# Altium project picoNODE.PrjPcb
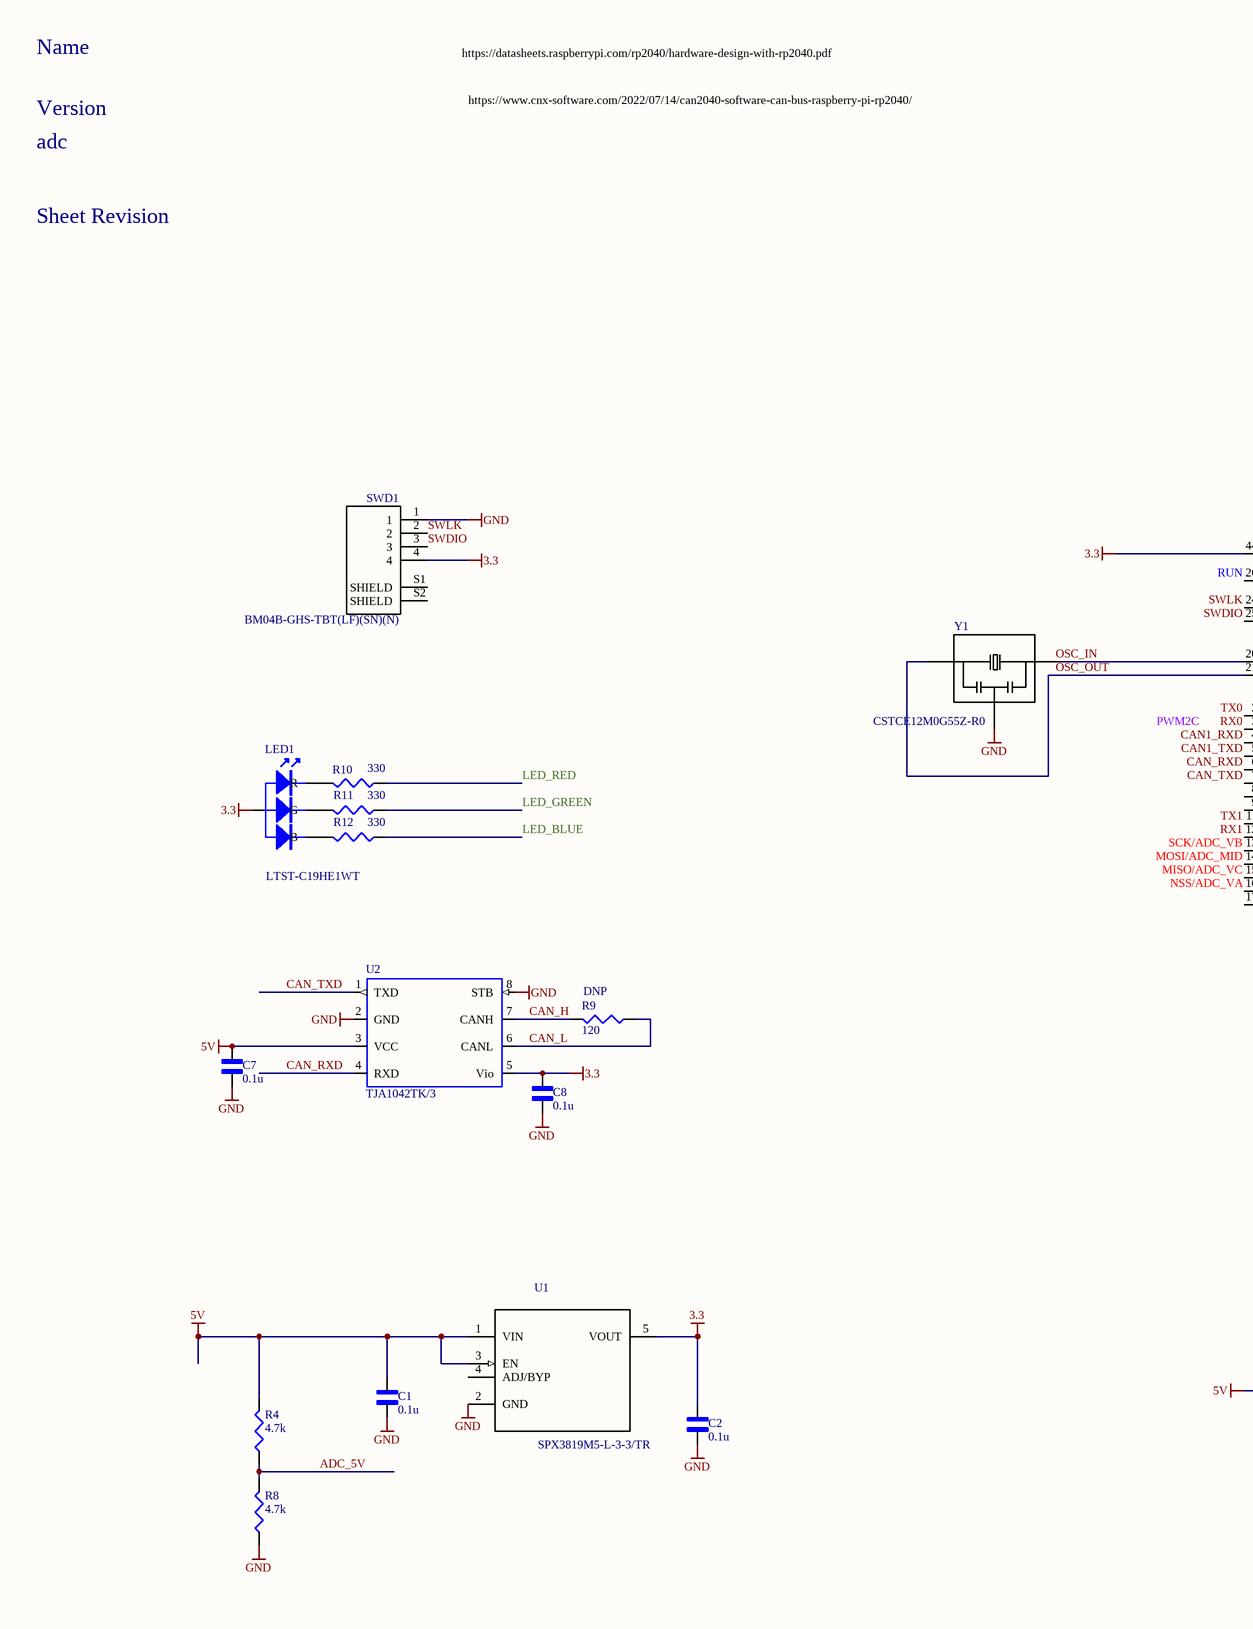
[diagram p0: RP2040.SchDoc, left]
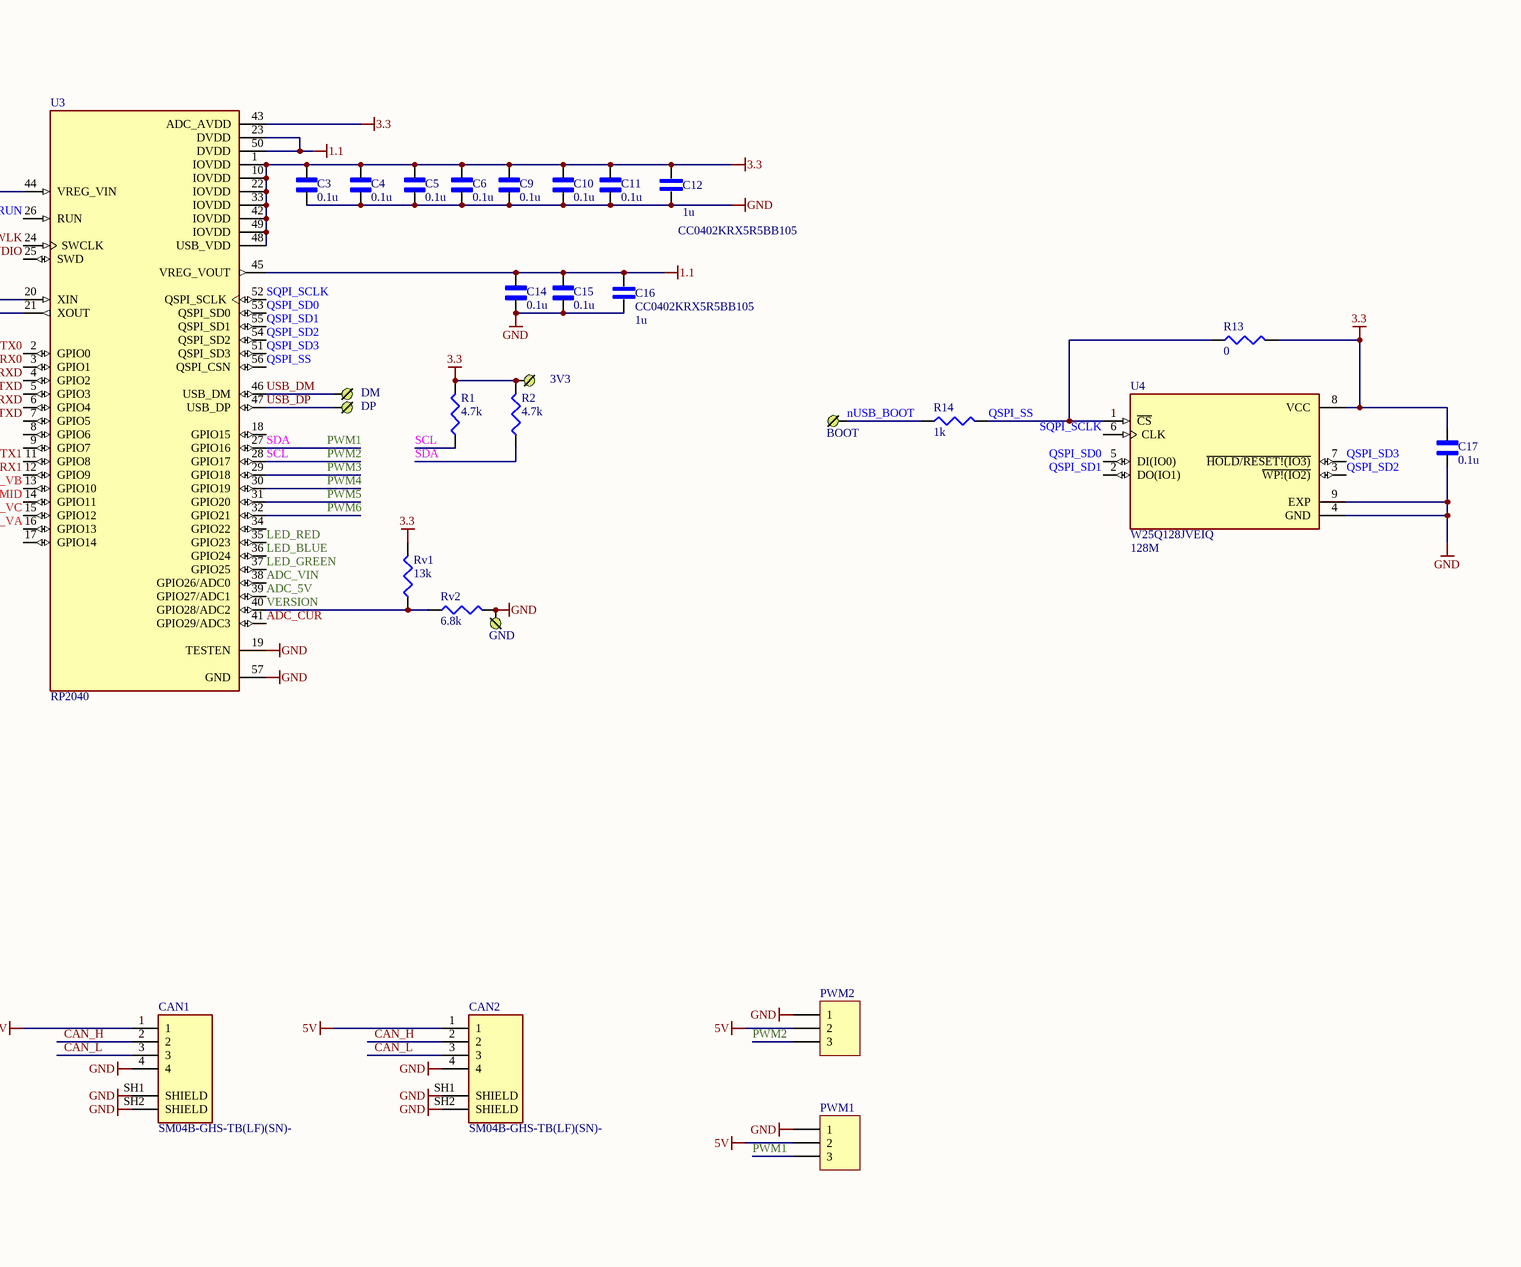
[diagram p1: RP2040.SchDoc, right]
Version: 3.1.0; ADC: 1406
1 sheet, 44 parts. Net scope: global (net labels, ports and power ports of the same name join across sheets).
Board file: PCB.PcbDoc

## Sheet RP2040.SchDoc
size A2; Revision: 10

### Parts
3V3  Test Point  [PAD1]  (value not drawn)
BOOT  Test Point  [PAD1]  (value not drawn)
C1  value 0.1u  [CAPC1005X55N]  (hidden comment: GCM155R71H104KE02D)
C2  value 0.1u  [CAPC1005X55N]  (hidden comment: GCM155R71H104KE02D)
C3  value 0.1u  [CAPC1005X55N]  (hidden comment: GCM155R71H104KE02D)
C4  value 0.1u  [CAPC1005X55N]  (hidden comment: GCM155R71H104KE02D)
C5  value 0.1u  [CAPC1005X55N]  (hidden comment: GCM155R71H104KE02D)
C6  value 0.1u  [CAPC1005X55N]  (hidden comment: GCM155R71H104KE02D)
C7  value 0.1u  [CAPC1005X55N]  (hidden comment: GCM155R71H104KE02D)
C8  value 0.1u  [CAPC1005X55N]  (hidden comment: GCM155R71H104KE02D)
C9  value 0.1u  [CAPC1005X55N]  (hidden comment: GCM155R71H104KE02D)
C10  value 0.1u  [CAPC1005X55N]  (hidden comment: GCM155R71H104KE02D)
C11  value 0.1u  [CAPC1005X55N]  (hidden comment: GCM155R71H104KE02D)
C12  CC0402KRX5R5BB105  value 1u  [CAPC1005X55N]
C14  value 0.1u  [CAPC1005X55N]  (hidden comment: GCM155R71H104KE02D)
C15  value 0.1u  [CAPC1005X55N]  (hidden comment: GCM155R71H104KE02D)
C16  CC0402KRX5R5BB105  value 1u  [CAPC1005X55N]
C17  value 0.1u  [CAPC1005X55N]  (hidden comment: GCM155R71H104KE02D)
CAN1  SM04B-GHS-TB(LF)(SN)-  [JST_SM04B-GHS-TB(LF)(SN)-]
CAN2  SM04B-GHS-TB(LF)(SN)-  [JST_SM04B-GHS-TB(LF)(SN)-]
DM  Test Point  [PAD1]  (value not drawn)
DP  Test Point  [PAD1]  (value not drawn)
GND  Test Point  [PAD1]  (value not drawn)
LED1  LTST-C19HE1WT  [LTST-C19HE1WT]
PWM1  A  [HDR Side 3 pin]  (value not drawn)
PWM2  A  [HDR Side 3 pin]  (value not drawn)
R1  value 4.7k  [RESC1005X40N]  (hidden comment: RC0402FR-074K7L)
R2  value 4.7k  [RESC1005X40N]  (hidden comment: RC0402FR-074K7L)
R4  value 4.7k  [RESC1005X40N]  (hidden comment: RC0402FR-074K7L)
R8  value 4.7k  [RESC1005X40N]  (hidden comment: RC0402FR-074K7L)
R9  value 120  Instructions: DNP  [J1-0603]  (hidden comment: Res3)
R10  value 330  [RESC1005X40N]  (hidden comment: RC0402FR-07330RL)
R11  value 330  [RESC1005X40N]  (hidden comment: RC0402FR-07330RL)
R12  value 330  [RESC1005X40N]  (hidden comment: RC0402FR-07330RL)
R13  value 0  [J1-0603]  (hidden comment: RC0603FR-070RL)
R14  value 1k  [RESC1005X40N]  (hidden comment: RC0402FR-071KL)
Rv1  value 13k  [RESC1005X40N]  (hidden comment: RC0402FR-0713KL)
Rv2  value 6.8k  [RESC1005X40N]  (hidden comment: RC0402FR-076K8L)
SWD1  BM04B-GHS-TBT(LF)(SN)(N)  [JST_BM04B-GHS-holes]
U1  SPX3819M5-L-3-3/TR  [*SOT95P280X145-5N]
U2  TJA1042TK/3  [SOT782-1]
U3  RP2040  [QFN40P700X700X90-57N]
U4  W25Q128JVEIQ  value 128M  [SON127P500X600X80-9N]
Y1  CSTCE12M0G55Z-R0  [*OSC_CSTCE8M00G55-R0]

### Nets
1.1: C14.2 C15.2 C16.1 U3.23(DVDD) U3.45(VREG_VOUT) U3.50(DVDD)
3.3: 3V3.1 C2.2 C3.2 C4.2 C5.2 C6.2 C8.2 C9.2 C10.2 C11.2 C12.1 C17.2 LED1.4(A) R1.2 R2.2 R13.2 Rv1.2 SWD1.4 U1.5(VOUT) U2.5(Vio) U3.1(IOVDD) U3.10(IOVDD) U3.22(IOVDD) U3.33(IOVDD) U3.42(IOVDD) U3.43(ADC_AVDD) U3.44(VREG_VIN) U3.48(USB_VDD) U3.49(IOVDD) U4.8(VCC)
5V: C1.2 C7.2 CAN1.1 CAN2.1 PWM1.2 PWM2.2 R4.2 U1.1(VIN) U1.3(EN) U2.3(VCC)
GND: C1.1 C2.1 C3.1 C4.1 C5.1 C6.1 C7.1 C8.1 C9.1 C10.1 C11.1 C12.2 C14.1 C15.1 C16.2 C17.1 CAN1.4 CAN1.SH1(SHIELD) CAN1.SH2(SHIELD) CAN2.4 CAN2.SH1(SHIELD) CAN2.SH2(SHIELD) GND.1 PWM1.1 PWM2.1 R8.1 Rv2.2 SWD1.1 U1.2(GND) U2.2(GND) U2.8(STB) U3.19(TESTEN) U3.57(GND) U4.4(GND) U4.9(EXP) Y1.2
ADC_5V: R4.1 R8.2 U3.39(GPIO27/ADC1)
ADC_CUR: U3.41(GPIO29/ADC3)
ADC_VIN: U3.38(GPIO26/ADC0)
CAN1_RXD: U3.4(GPIO2)
CAN1_TXD: U3.5(GPIO3)
CAN_H: CAN1.2 CAN2.2 R9.2 U2.7(CANH)
CAN_L: CAN1.3 CAN2.3 R9.1 U2.6(CANL)
CAN_RXD: U2.4(RXD) U3.6(GPIO4)
CAN_TXD: U2.1(TXD) U3.7(GPIO5)
LED_BLUE: R12.1 U3.36(GPIO24)
LED_GREEN: R11.1 U3.37(GPIO25)
LED_RED: R10.1 U3.35(GPIO23)
MISO/ADC_VC: U3.15(GPIO12)
MOSI/ADC_MID: U3.14(GPIO11)
NSS/ADC_VA: U3.16(GPIO13)
nUSB_BOOT: BOOT.1 R14.1
OSC_OUT: U3.21(XOUT) Y1.1
PWM1: PWM1.3 R2.1 U3.27(GPIO16)  [also labelled SDA]
PWM2: PWM2.3 R1.1 U3.28(GPIO17)  [also labelled SCL]
PWM3: U3.29(GPIO18)
PWM4: U3.30(GPIO19)
PWM5: U3.31(GPIO20)
PWM6: U3.32(GPIO21)
QSPI_SD0: U3.53(QSPI_SD0) U4.5(DI(IO0))
QSPI_SD1: U3.55(QSPI_SD1) U4.2(DO(IO1))
QSPI_SD2: U3.54(QSPI_SD2) U4.3(~{WP!(IO2)})
QSPI_SD3: U3.51(QSPI_SD3) U4.7(~{HOLD/RESET!(IO3)})
QSPI_SS: R13.1 R14.2 U3.56(QSPI_CSN) U4.1(~{CS})
RUN: U3.26(RUN)
RX0: U3.3(GPIO1)
RX1: U3.12(GPIO9)
SCK/ADC_VB: U3.13(GPIO10)
SQPI_SCLK: U3.52(QSPI_SCLK) U4.6(CLK)
SWDIO: SWD1.3 U3.25(SWD)
SWLK: SWD1.2 U3.24(SWCLK)
TX0: U3.2(GPIO0)
TX1: U3.11(GPIO8)
USB_DM: DM.1 U3.46(USB_DM)
USB_DP: DP.1 U3.47(USB_DP)
VERSION: Rv1.1 Rv2.1 U3.40(GPIO28/ADC2)
NetLED1_1: LED1.1(R) R10.2
NetLED1_2: LED1.2(G) R11.2
NetLED1_3: LED1.3(B) R12.2
NetU3_20: U3.20(XIN) Y1.3

Not connected (* = marked no-connect by the designer): SWD1 S1(SHIELD) S2(SHIELD); U1 4(ADJ/BYP); U3 8(GPIO6) 9(GPIO7) 17(GPIO14) 18(GPIO15) 34(GPIO22)

### Notes on the sheet
- Name
- https://datasheets.raspberrypi.com/rp2040/hardware-design-with-rp2040.pdf
- Version
- https://www.cnx-software.com/2022/07/14/can2040-software-can-bus-raspberry-pi-rp2040/
- adc
- Sheet Revision
- Labels drawn without touching a wire or pin: OSC_IN, PWM2C

### Library data of the parts
3V3 BOOT DM DP GND = PLUG: Instructions: Test point
C1-C11 C14 C15 C17 = GCM155R71H104KE02D: GCM155R71H104KE02D, Чип 0402 X7R 0.1uF +10% 50V,Конденсатор; MF: Murata; SnapEDA_Link: https://www.snapeda.com/parts/GCM155R71H104KE02D/Murata%20Electronics%20North%20America/view-part/597463/?ref=snap; Package: 0402; MP: GCM155R71H104KE02D; ChipDip_Link: https://www.chipdip.ru/product/gcm155r71h104ke02d-murata
C12 C16 = CC0402KRX5R5BB105: 10% 6.3V Ceramic Capacitor X5R 0402 _1005 Metric_; MF: Yageo; Price: None; Availability: Unavailable; Package: 0402; SnapEDA_Link: https://www.snapeda.com/parts/CC0402KRX5R5BB105/Yageo/view-part/105653/?ref=snap; MP: CC0402KRX5R5BB105
CAN1 CAN2 = SM04B-GHS-TB(LF)(SN)-: Connector Header Surface Mount, Right Angle 4 position 0.049 _1.25mm_; MF: JST Sales; MP: SM04B-GHS-TB(LF)(SN); Package: None; Value: *; SnapEDA_Link: https://www.snapeda.com/parts/SM04B-GHS-TB%28LF%29%28SN%29-/JST%20Sales%20America%20Inc./view-part/2759740/?ref=snap; HelpURL: http://www.farnell.com/datasheets/2082975.pdf; System: Connector; ChipDip_Link: https://www.chipdip.ru/product/sm04b-ghs-tb-lf-sn-gh-1.25mm-header-side-ent
LED1 = RGB_LED_5MM: Blue/Green/Red; ChipDip_Link: https://www.chipdip.ru/product1/8003387462; HelpURL: https://static.chipdip.ru/lib/039/DOC013039662.pdf; MP: LTST-C19HE1WT
PWM1 PWM2 = Header 3: Header, 3-Pin; System: Connector; MF: Connfly electronic (Zhenqin); MP: PLS-3 (DS1021-1x3); Type: SMD; ChipDip_Link: https://www.chipdip.ru/product/pls-3; HelpURL: https://static.chipdip.ru/lib/227/DOC000227157.pdf
R1 R2 R4 R8 = RC0402FR-074K7L: 0.062Вт 0402 4.7 кОм, 1%, Чип резистор (SMD); Pacage Metric: 1005; MF: Yageo or NXP; ChipDip_Link: https://www.chipdip.ru/product0/9000189640; HelpURL: https://www.chipdip.ru/product0/9000189640; Package: RC0402; Type: SMD; MP: RC0402FR-074K7L; SnapEDA_Link: https://www.snapeda.com/parts/CRGCQ0402F10K/TE%20Connectivity/view-part/3186991/?ref=search&t=0402%2010k
R9 = Res3: 120 Ohms 1 0.1 W 1 10 W Chip Resistor 0603 1608 Metric Thick Film; Pacage Metric: 1608; MP: RC0603FR-07120RL; ChipDip_Link: https://www.chipdip.ru/product0/9000079618; HelpURL: https://www.chipdip.ru/product0/9000079618; Package: R0603; Type: SMD
R10-R12 = RC0402FR-07330RL: 0.062Вт 0402 330 Ом, 1%, Чип резистор (SMD); Pacage Metric: 1005; MF: Yageo or NXP; ChipDip_Link: https://www.chipdip.ru/product0/9000189640; HelpURL: https://www.chipdip.ru/product0/9000189640; Package: RC0402; Type: SMD; MP: RC0402FR-07330RL; SnapEDA_Link: https://www.snapeda.com/parts/CRGCQ0402F10K/TE%20Connectivity/view-part/3186991/?ref=search&t=0402%2010k
R13 = RC0603FR-070RL: 0 Ohms ±1% 0.1W, 1/10W Chip Resistor 0603 (1608 Metric) Moisture Resistant Thick Film; Instructions: DNP; MF: Yageo or NXP; HelpURL: https://www.yageo.com/upload/media/product/productsearch/datasheet/rchip/PYu-RC_Group_51_RoHS_L_10.pdf; MP: RC0603FR-070RL; Package: R0603; SnapEDA_Link: https://www.snapeda.com/parts/RC0603FR-101KL/Yageo/view-part/?ref=search&t=RC0603FR-07%201k; Type: SMD
R14 = RC0402FR-071KL: 0.062Вт 0402 1 кОм, 1%, Чип резистор (SMD); MF: Yageo or NXP; ChipDip_Link: https://www.chipdip.ru/product0/9000189640; HelpURL: https://www.chipdip.ru/product0/9000189640; Package: RC0402; Type: SMD; MP: RC0402FR-071KL; SnapEDA_Link: https://www.snapeda.com/parts/CRGCQ0402F10K/TE%20Connectivity/view-part/3186991/?ref=search&t=0402%2010k
Rv1 = RC0402FR-0713KL: 0.062Вт 0402 13 кОм, 1%, Чип резистор (SMD); Pacage Metric: 1005; MF: Yageo or NXP; ChipDip_Link: https://www.chipdip.ru/product0/9000189640; HelpURL: https://www.chipdip.ru/product0/9000189640; Package: RC0402; Type: SMD; MP: RC0402FR-0713KL; SnapEDA_Link: https://www.snapeda.com/parts/CRGCQ0402F10K/TE%20Connectivity/view-part/3186991/?ref=search&t=0402%2010k
Rv2 = RC0402FR-076K8L: 0.062Вт 0402 6.8 кОм, 1%, Чип резистор (SMD); Pacage Metric: 1005; MF: Yageo or NXP; ChipDip_Link: https://www.chipdip.ru/product0/9000189640; HelpURL: https://www.chipdip.ru/product0/9000189640; Package: RC0402; Type: SMD; MP: RC0402FR-076K8L; SnapEDA_Link: https://www.snapeda.com/parts/CRGCQ0402F10K/TE%20Connectivity/view-part/3186991/?ref=search&t=0402%2010k
SWD1 = BM04B-GHS-TBT(LF)(SN)(N): Conn Shrouded Header HDR 4 POS 1.25mm Solder ST SMD Reel; MF: JST Sales; MP: SM04B-GHS-TB(LF)(SN); Instructions: DNP; System: Connector; SnapEDA_Link: https://www.snapeda.com/parts/BM04B-GHS-TBT%28LF%29%28SN%29%28N%29/JST%20Sales%20America%20Inc./view-part/?ref=snap; Package: None; Value: *; Type: SMD
U1 = SPX3819M5-L: Low Dropout Voltage Regulator, Adjustable 0.5A, В±1%, 2.5 to 16 Vin, 5-Pin SOT-23; MF: MaxLinear, Inc.; Value: 3V3; MP: SPX3819M5-L-3-3/TR; Package: SOT-23-5 Exar; SnapEDA_Link: https://www.snapeda.com/parts/SPX3819M5-L/MaxLinear%2C%20Inc./view-part/?ref=snap; Type: SMD; ChipDip_Link: https://www.chipdip.ru/product1/8003455237; HelpURL: http://www.farnell.com/datasheets/2614478.pdf
U2 = TJA1042TK/3: 1/1 Transceiver Half CANbus 8-SO; MF: NXP USA; SnapEDA_Link: https://www.snapeda.com/parts/TJA1042/NXP%20USA%20Inc./view-part/900919/?ref=snap; Value: *; MP: TJA1042TK/3; Package: VDFN-8 NXP USA; ChipDip_Link: https://www.chipdip.ru/product1/8002988465; HelpURL: https://static.chipdip.ru/lib/583/DOC001583059.pdf; Type: SMD
U4 = W25Q128JVEIQ: FLASH - NOR Memory IC 128Mb (16M x 8) SPI - Quad I/O, QPI, DTR 133 MHz 8-SOIC; MF: Winbond Electronics; MP: W25Q128JVSIQ; Price: None; Purchase-URL: https://pricing.snapeda.com/search/part/W25Q128JVSIQ/?ref=eda; Check_prices: https://www.snapeda.com/parts/W25Q128JVSIQ/Winbond+Electronics/view-part/?ref=eda; Package: WSON-8 Winbond; SnapEDA_Link: https://www.snapeda.com/parts/W25Q128JVSIQ/Winbond+Electronics/view-part/?ref=snap; Availability: In Stock
Y1 = CSTCE12M0G55Z-R0: Ceramic Resonator, 12 MHz, +/- 0.5%, -40 to 125 degC, 3-Pin SMD, RoHS, Tape and Reel; MF: Murata; Value: 12MHz; MP: CSTCE12M0G55Z-R0; Package: SMD-3 Murata; SnapEDA_Link: https://www.snapeda.com/parts/CSTCE8M00G55-R0/Murata%20Electronics%20North%20America/view-part/?ref=snap; ChipDip_Link: https://www.chipdip.ru/product1/8001783721; HelpURL: https://www.murata.com/en-eu/api/pdfdownloadapi?cate=&partno=CSTCE8M00G55-R0; Type: SMD
U3 = RP2040: Value: *; Availability: Unavailable; Price: None; MP: RP2040; Package: None